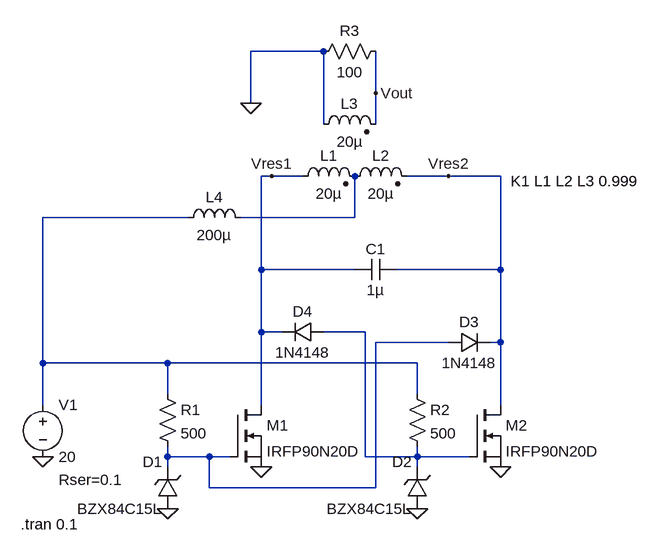
[diagram p0: schematic Draft1.asc]
Draft1.asc, the LTspice schematic file:
Version 4
SHEET 1 880 680
WIRE 272 -400 160 -400
WIRE 352 -336 352 -400
WIRE 160 -320 160 -400
WIRE 272 -288 272 -400
WIRE 352 -288 352 -336
WIRE 192 -208 176 -208
WIRE 240 -208 192 -208
WIRE 464 -208 400 -208
WIRE 544 -208 464 -208
WIRE 64 -144 -160 -144
WIRE 320 -144 320 -208
WIRE 320 -144 144 -144
WIRE 176 -64 176 -208
WIRE 320 -64 176 -64
WIRE 544 -64 544 -208
WIRE 544 -64 384 -64
WIRE 176 32 176 -64
WIRE 208 32 176 32
WIRE 336 32 272 32
WIRE 464 48 352 48
WIRE 544 48 544 -64
WIRE 544 48 528 48
WIRE -160 80 -160 -144
WIRE 32 80 -160 80
WIRE 416 80 32 80
WIRE 32 128 32 80
WIRE 416 128 416 80
WIRE -160 144 -160 80
WIRE 176 144 176 32
WIRE 544 144 544 48
WIRE 32 224 32 208
WIRE 96 224 32 224
WIRE 128 224 96 224
WIRE 336 224 336 32
WIRE 416 224 416 208
WIRE 416 224 336 224
WIRE 496 224 416 224
WIRE 32 240 32 224
WIRE 416 240 416 224
WIRE 96 272 96 224
WIRE 352 272 352 48
WIRE 352 272 96 272
FLAG 176 240 0
FLAG 544 240 0
FLAG -160 224 0
FLAG 32 304 0
FLAG 416 304 0
FLAG 160 -320 0
FLAG 352 -336 Vout
FLAG 192 -208 Vres1
FLAG 464 -208 Vres2
SYMBOL nmos 128 144 R0
SYMATTR InstName M1
SYMATTR Value IRFP90N20D
SYMBOL nmos 496 144 R0
SYMATTR InstName M2
SYMATTR Value IRFP90N20D
SYMBOL voltage -160 128 R0
WINDOW 123 0 0 Left 0
WINDOW 39 24 132 Left 0
SYMATTR InstName V1
SYMATTR Value 20
SYMATTR SpiceLine Rser=0.1
SYMBOL res 16 112 R0
SYMATTR InstName R1
SYMATTR Value 500
SYMBOL res 400 112 R0
SYMATTR InstName R2
SYMATTR Value 500
SYMBOL zener 48 304 R180
WINDOW 0 24 72 Left 0
WINDOW 3 24 0 Left 0
SYMATTR InstName D1
SYMATTR Value BZX84C15L
SYMATTR Description Diode
SYMATTR Type diode
SYMBOL zener 432 304 R180
WINDOW 0 24 72 Left 0
WINDOW 3 24 0 Left 0
SYMATTR InstName D2
SYMATTR Value BZX84C15L
SYMATTR Description Diode
SYMATTR Type diode
SYMBOL diode 464 64 R270
WINDOW 0 32 32 VTop 0
WINDOW 3 0 32 VBottom 0
SYMATTR InstName D3
SYMATTR Value 1N4148
SYMBOL diode 272 16 R90
WINDOW 0 0 32 VBottom 0
WINDOW 3 32 32 VTop 0
SYMATTR InstName D4
SYMATTR Value 1N4148
SYMBOL cap 384 -80 R90
WINDOW 0 0 32 VBottom 0
WINDOW 3 32 32 VTop 0
SYMATTR InstName C1
SYMATTR Value 1µ
SYMBOL ind2 224 -192 R270
WINDOW 0 32 56 VTop 0
WINDOW 3 5 56 VBottom 0
SYMATTR InstName L1
SYMATTR Value 20µ
SYMATTR Type ind
SYMBOL ind2 304 -192 R270
WINDOW 0 32 56 VTop 0
WINDOW 3 5 56 VBottom 0
SYMATTR InstName L2
SYMATTR Value 20µ
SYMATTR Type ind
SYMBOL ind2 256 -272 R270
WINDOW 0 32 56 VTop 0
WINDOW 3 5 56 VBottom 0
SYMATTR InstName L3
SYMATTR Value 20µ
SYMATTR Type ind
SYMBOL ind 48 -128 R270
WINDOW 0 32 56 VTop 0
WINDOW 3 5 56 VBottom 0
SYMATTR InstName L4
SYMATTR Value 200µ
SYMATTR SpiceLine Rser=0.02
SYMBOL res 368 -416 R90
WINDOW 0 0 56 VBottom 0
WINDOW 3 32 56 VTop 0
SYMATTR InstName R3
SYMATTR Value 100
TEXT 560 -200 Left 0 !K1 L1 L2 L3 0.999
TEXT -194 328 Left 0 !.tran 0.1

The netlist it stands for:
* Draft1.asc
M1 Vres1 N004 0 0 IRFP90N20D
M2 Vres2 N003 0 0 IRFP90N20D
V1 N001 0 20 Rser=0.1
R1 N001 N004 500
R2 N001 N003 500
D1 0 N004 BZX84C15L
D2 0 N003 BZX84C15L
D3 N004 Vres2 1N4148
D4 N003 Vres1 1N4148
C1 Vres2 Vres1 1µ
L1 Vres1 N002 20µ
L2 N002 Vres2 20µ
L3 0 Vout 20µ
L4 N001 N002 200µ Rser=0.02
R3 Vout 0 100
.model D D
.lib standard.dio
.model NMOS NMOS
.model PMOS PMOS
.lib standard.mos
K1 L1 L2 L3 0.999
.tran 0.1
.backanno
.end